# Altium schematic sheet 09 UART,JTAG,GPIO.SchDoc
size 513 x 386 mm
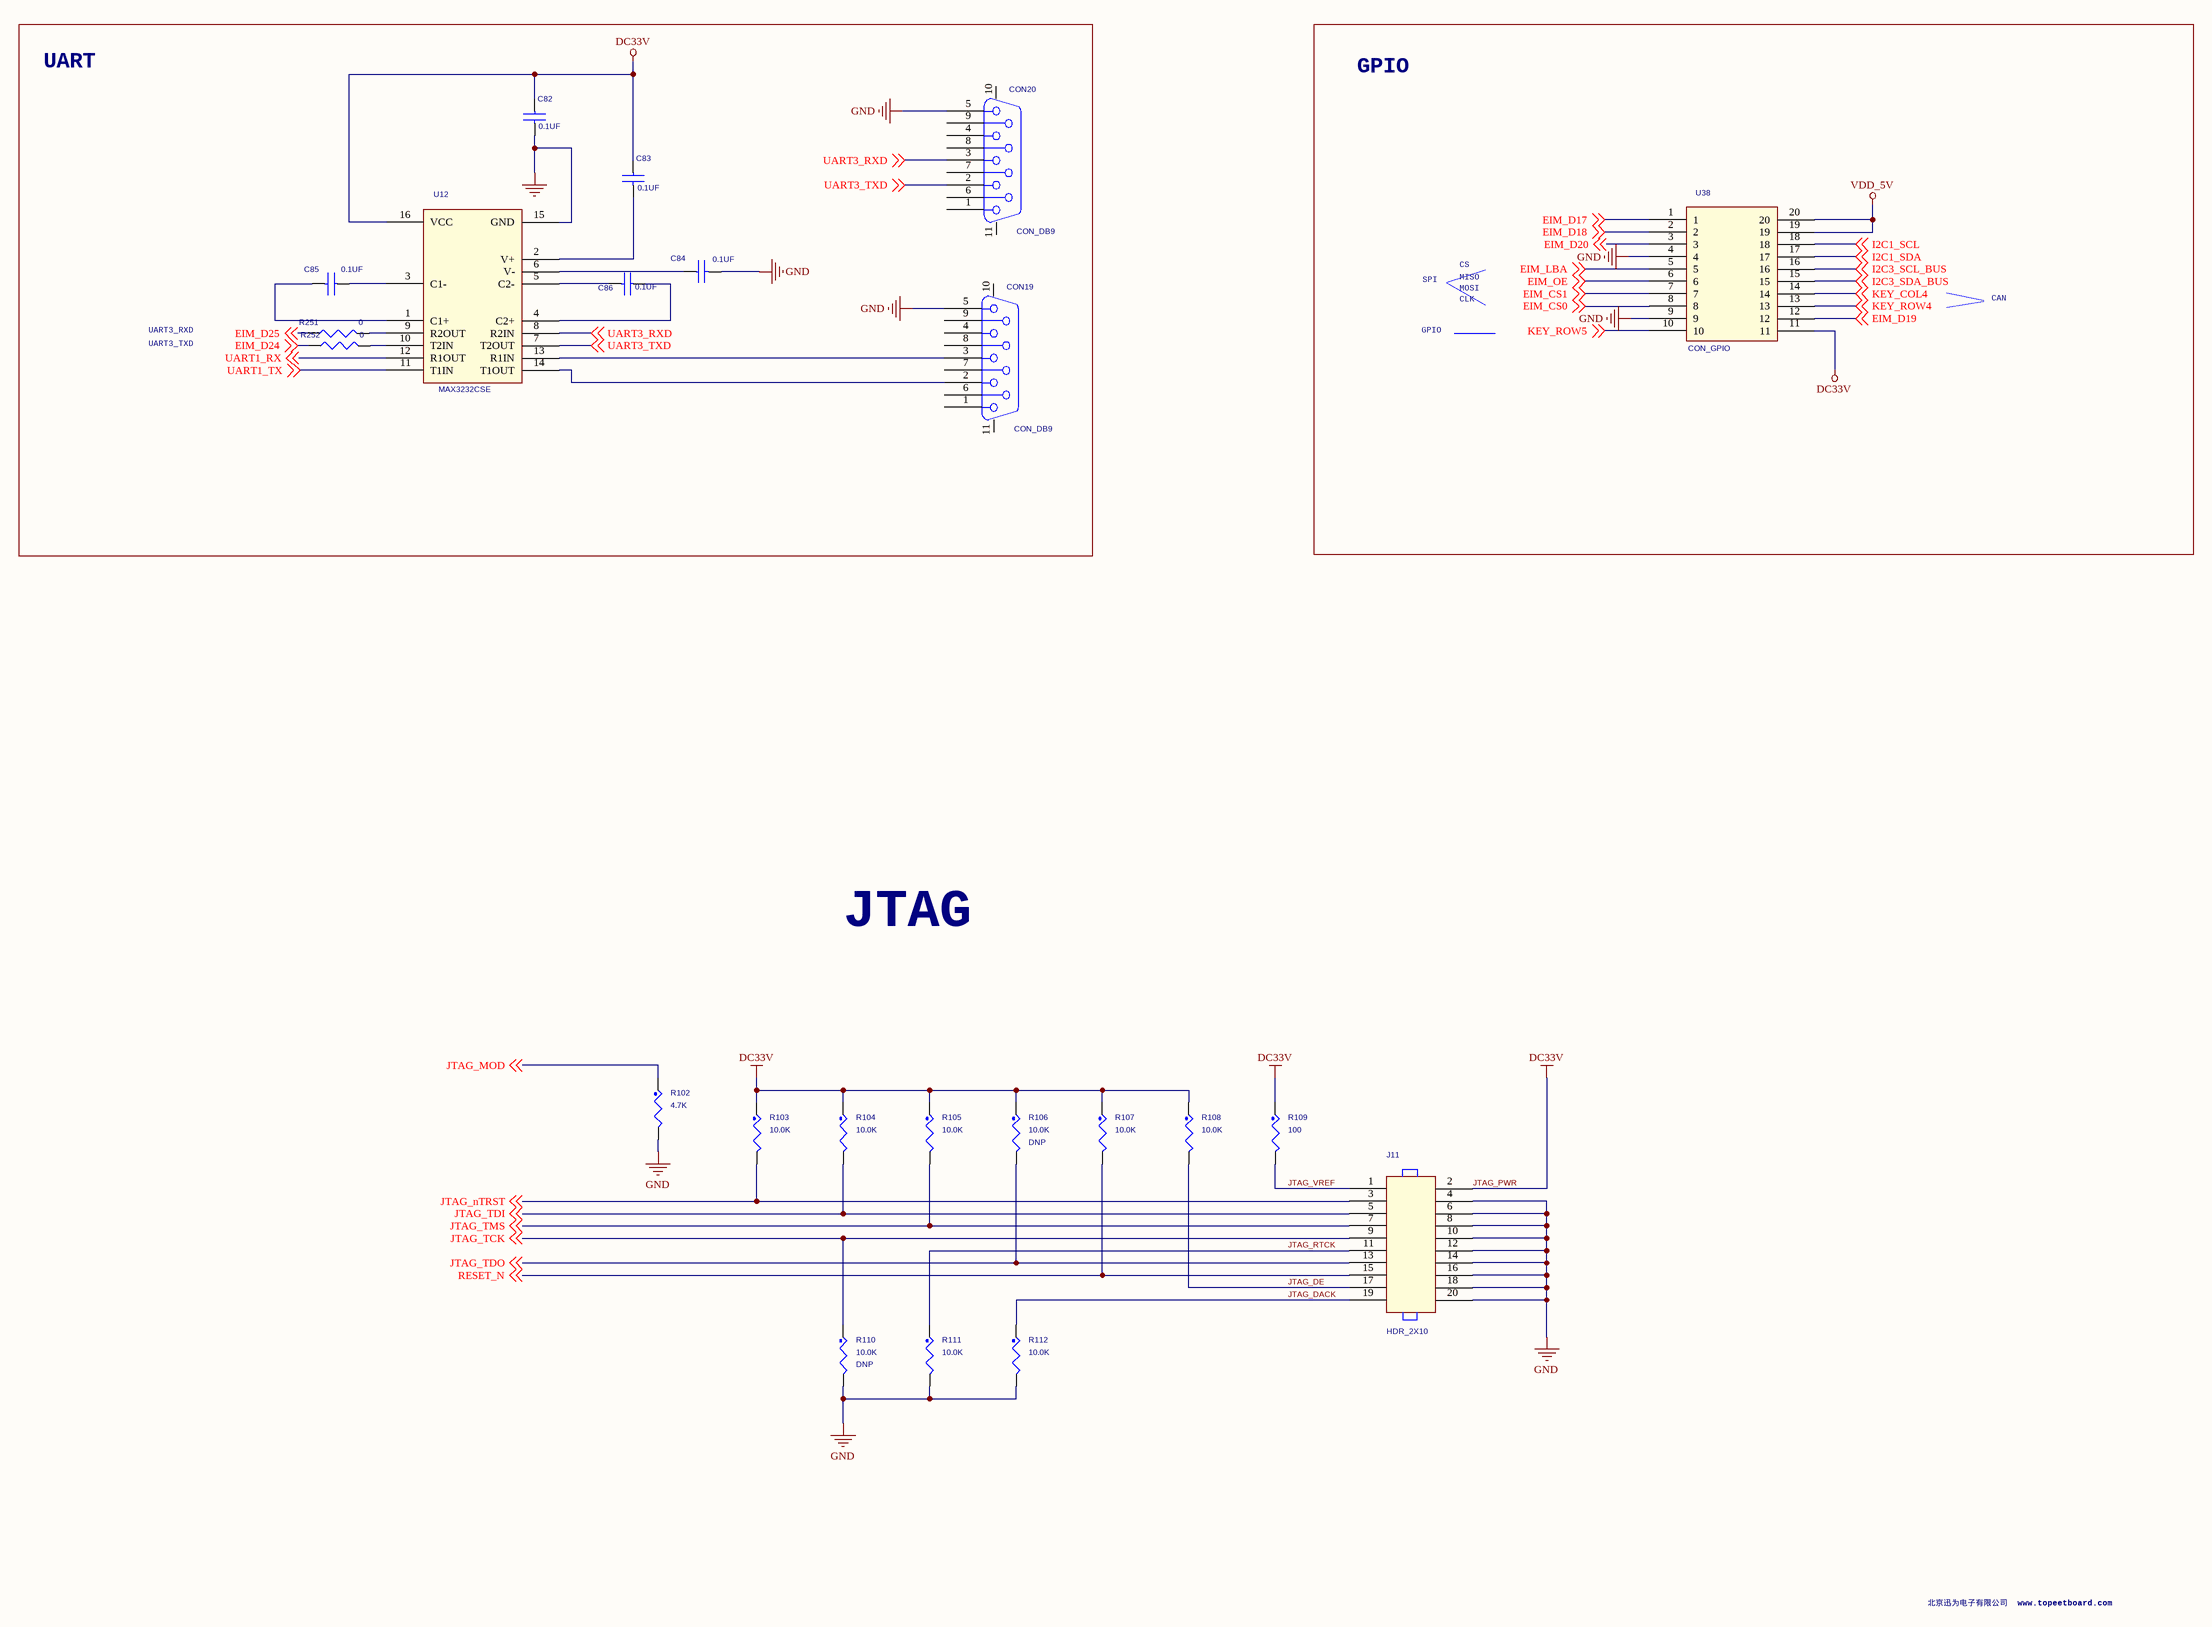
[diagram p0: 09 UART,JTAG,GPIO.SchDoc]

## Parts
C82  0.1UF  [C0603]
C83  0.1UF  [C0603]
C84  0.1UF  [C0603]
C85  0.1UF  [C0603]
C86  0.1UF  [C0603]
CON19  CON_DB9  [DB9]
CON20  CON_DB9  [DB9]
J11  HDR_2X10  [HDRMS2MM-2X10]
R102  4.7K  [R0402]
R103  10.0K  [R0402]
R104  10.0K  [R0402]
R105  10.0K  [R0402]
R106  10.0K  ASSY_OPT: DNP  [R0402]
R107  10.0K  [R0402]
R108  10.0K  [R0402]
R109  100  [R0402]
R110  10.0K  ASSY_OPT: DNP  [R0402]
R111  10.0K  [R0402]
R112  10.0K  [R0402]
R251  0  [R1005]
R252  0  [R1005]
U12  MAX3232CSE  [16]
U38  CON_GPIO  [HDRMS2MM-2X10]

## Blocks framed on the sheet
UART: C82-C86 CON19 CON20 R251 R252 U12
GPIO: U38

## Nets
GND: C82.2 C84.2 CON19.5 CON20.5 J11.4 J11.6 J11.8 J11.10 J11.12 J11.14 J11.16 J11.18 J11.20 R102.2 R110.2 R111.2 R112.2 U12.15(GND) U38.4 U38.9
JTAG_PWR: C82.1 C83.1 J11.2 R103.1 R104.1 R105.1 R106.1 R107.1 R108.1 R109.1 U12.16(VCC) U38.11  [also labelled DC33V]
VDD_5V: U38.19 U38.20
EIM_CS0: U38.8 ; off-sheet EIM_CS0
EIM_CS1: U38.7 ; off-sheet EIM_CS1
EIM_D17: U38.1 ; off-sheet EIM_D17
EIM_D18: U38.2 ; off-sheet EIM_D18
EIM_D19: U38.12 ; off-sheet EIM_D19
EIM_D20: U38.3 ; off-sheet EIM_D20
EIM_D24: R252.1 ; off-sheet EIM_D24
EIM_D25: R251.1 ; off-sheet EIM_D25
EIM_LBA: U38.5 ; off-sheet EIM_LBA
EIM_OE: U38.6 ; off-sheet EIM_OE
I2C1_SCL: U38.18 ; off-sheet I2C1_SCL
I2C1_SDA: U38.17 ; off-sheet I2C1_SDA
I2C3_SCL_BUS: U38.16 ; off-sheet I2C3_SCL_BUS
I2C3_SDA_BUS: U38.15 ; off-sheet I2C3_SDA_BUS
JTAG_DACK: J11.19 R112.1
JTAG_DE: J11.17 R108.2
JTAG_MOD: R102.1 ; off-sheet JTAG_MOD
JTAG_nTRST: J11.3 R103.2 ; off-sheet JTAG_nTRST
JTAG_RTCK: J11.11 R111.1
JTAG_TCK: J11.9 R110.1 ; off-sheet JTAG_TCK
JTAG_TDI: J11.5 R104.2 ; off-sheet JTAG_TDI
JTAG_TDO: J11.13 R106.2 ; off-sheet JTAG_TDO
JTAG_TMS: J11.7 R105.2 ; off-sheet JTAG_TMS
JTAG_VREF: J11.1 R109.2
KEY_COL4: U38.14 ; off-sheet KEY_COL4
KEY_ROW4: U38.13 ; off-sheet KEY_ROW4
KEY_ROW5: U38.10 ; off-sheet KEY_ROW5
RESET_N: J11.15 R107.2 ; off-sheet RESET_N
UART1_RX: U12.12(R1OUT) ; off-sheet UART1_RX
UART1_TX: U12.11(T1IN) ; off-sheet UART1_TX
UART3_RXD: CON20.3 U12.8(R2IN) ; off-sheet UART3_RXD
UART3_TXD: CON20.2 U12.7(T2OUT) ; off-sheet UART3_TXD
NetC83_2: C83.2 U12.2(V+)
NetC84_1: C84.1 U12.6(V-)
NetC85_1: C85.1 U12.3(C1-)
NetC85_2: C85.2 U12.1(C1+)
NetC86_1: C86.1 U12.4(C2+)
NetC86_2: C86.2 U12.5(C2-)
NetCON19_2: CON19.2 U12.14(T1OUT)
NetCON19_3: CON19.3 U12.13(R1IN)
NetR251_2: R251.2 U12.9(R2OUT)
NetR252_2: R252.2 U12.10(T2IN)

Not connected (* = marked no-connect by the designer): CON19 1 4 6 7 8 9 10 11; CON20 1 4 6 7 8 9 10 11

## Notes on the sheet
- CS
- SPI
- MISO
- MOSI
- CLK
- CAN
- UART3_RXD
- UART3_TXD
- GPIO
- JTAG
- 北京迅为电子有限公司  www.topeetboard.com

## Library data of the parts
C82-C86 = C0603_0_Dup1
J11 = HDR_2X10: HDR 2X10 TH SHRD 100MIL CTR 393H AU 120L; AGILE_PN: 210-79722; MFG_NAME01: Tyco Electronics; MFG_PN01: 5103308-5; CAD_APPROVED: Yes; ROHS: Yes; HEIGHT: 9.98MM
R102 = RES_Dup1: RES MF 4.70K 1/16W 1% 0402; AGILE_PN: 470-75418; MFG_NAME01: KOA SPEER; MFG_PN01: RK73H1ETTP4701F; CAD_APPROVED: Yes; PRIORITY_PN: 006-00619; ROOM: MARLEY; SIGNAL_MODEL: DEFAULT_RESISTOR_4700OHM_2_1; Tolerance: 1%; ROHS: Yes
R103-R108 R110 R111 = RES_Dup1: RES MF 10.0K 1/16W 1% AEC-Q200 0402; AGILE_PN: 470-75416; MFG_NAME01: KOA SPEER; MFG_PN01: RK73H1ETTP1002F; CAD_APPROVED: Yes; FPLIST: RC0402_25,RC0402_HD,0402_CC; SIGNAL_MODEL: DEFAULT_RESISTOR_10000OHM_2_1; Tolerance: 1%; ROHS: Yes
R109 = RES_Dup1: RES MF 100 OHM 1/16W 1% 0402; AGILE_PN: 470-30454; MFG_NAME01: THYE MING TECH CO LTD; MFG_PN01: CR-02FL6--100R; CAD_APPROVED: Yes; FPLIST: RC0402_25,RC0402_HD,0402_CC; SIGNAL_MODEL: DEFAULT_RESISTOR_100OHM_2_1; Tolerance: 1%; ROHS: Yes
R112 = RES_Dup1: RES MF 10.0K 1/16W 1% AEC-Q200 0402; FPLIST: RC0402_25,RC0402_HD,0402_CC; CAD_APPROVED: Yes; MFG_PN01: RK73H1ETTP1002F; MFG_NAME01: KOA SPEER; AGILE_PN: 470-75416; SIGNAL_MODEL: DEFAULT_RESISTOR_10000OHM_2_1; ROHS: Yes; Tolerance: 1%
R251 R252 = R1005_0_Dup1
U12 = MAX3232EEAE
U38 = CON20_1